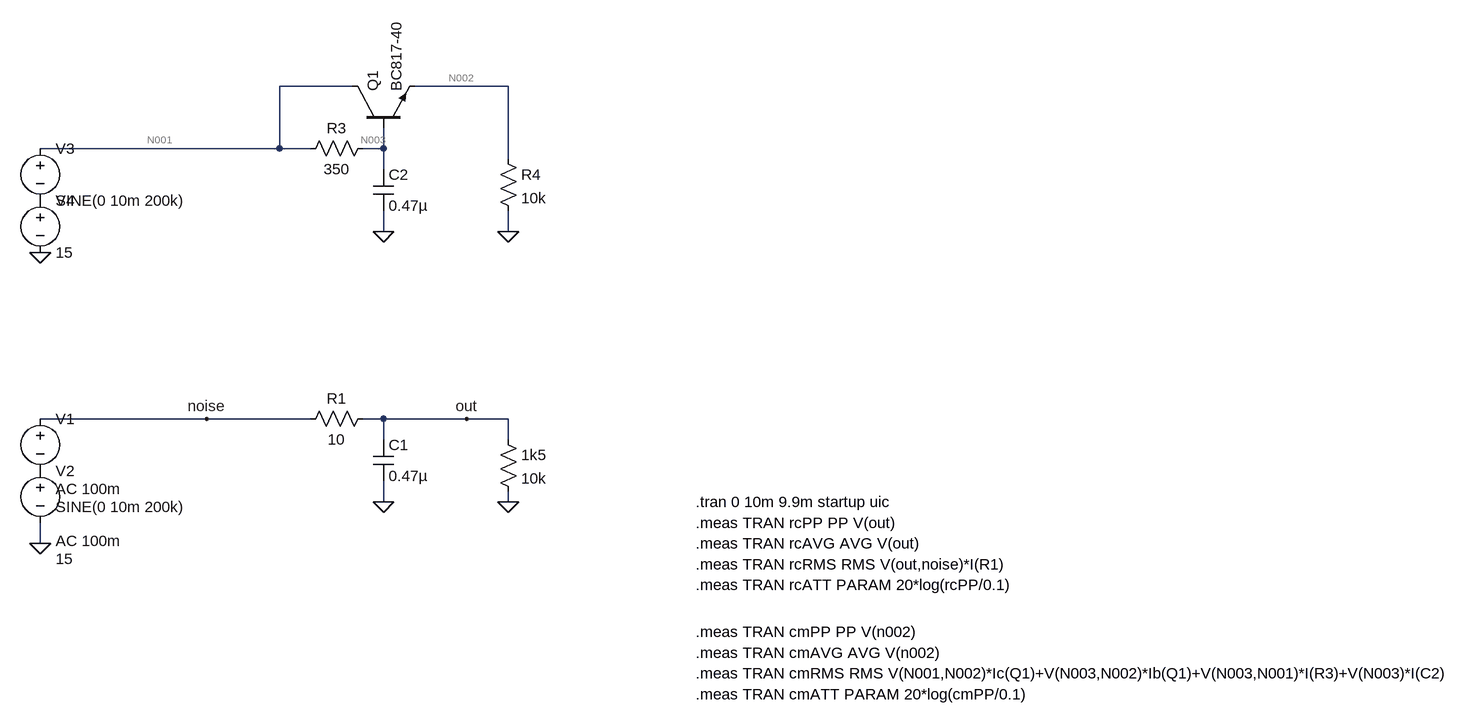
[diagram p0: schematic Capacitance multiplier.asc]
Capacitance multiplier.asc, the LTspice schematic file:
Version 4
SHEET 1 2472 732
WIRE 784 -432 672 -432
WIRE 1024 -432 880 -432
WIRE 672 -336 672 -432
WIRE 672 -336 304 -336
WIRE 720 -336 672 -336
WIRE 832 -336 832 -368
WIRE 832 -336 800 -336
WIRE 1024 -320 1024 -432
WIRE 832 -304 832 -336
WIRE 832 -208 832 -240
WIRE 1024 -208 1024 -240
WIRE 560 80 304 80
WIRE 720 80 560 80
WIRE 832 80 800 80
WIRE 960 80 832 80
WIRE 1024 80 960 80
WIRE 832 112 832 80
WIRE 1024 112 1024 80
WIRE 832 208 832 176
WIRE 1024 208 1024 192
WIRE 304 272 304 240
FLAG 304 272 0
FLAG 832 208 0
FLAG 560 80 noise
FLAG 960 80 out
FLAG 1024 208 0
FLAG 832 -208 0
FLAG 1024 -208 0
FLAG 304 -176 0
SYMBOL voltage 304 64 R0
WINDOW 3 24 152 Left 2
WINDOW 123 24 124 Left 2
WINDOW 39 0 0 Left 0
SYMATTR Value SINE(0 10m 200k)
SYMATTR Value2 AC 100m
SYMATTR InstName V1
SYMBOL res 816 64 R90
WINDOW 0 0 56 VBottom 2
WINDOW 3 32 56 VTop 2
SYMATTR InstName R1
SYMATTR Value 10
SYMBOL cap 816 112 R0
SYMATTR InstName C1
SYMATTR Value 0.47µ
SYMATTR SpiceLine V=25 Irms=3.94 Rser=0.0265693 Lser=0 mfg="KEMET" pn="C0603C474K3PAC" type="X5R"
SYMBOL voltage 304 144 R0
WINDOW 3 24 152 Left 2
WINDOW 123 24 124 Left 2
WINDOW 39 0 0 Left 0
SYMATTR Value 15
SYMATTR Value2 AC 100m
SYMATTR InstName V2
SYMBOL res 1008 96 R0
SYMATTR InstName 1k5
SYMATTR Value 10k
SYMBOL cap 816 -304 R0
SYMATTR InstName C2
SYMATTR Value 0.47µ
SYMATTR SpiceLine V=25 Irms=3.94 Rser=0.0265693 Lser=0 mfg="KEMET" pn="C0603C474K3PAC" type="X5R"
SYMBOL res 816 -352 R90
WINDOW 0 0 56 VBottom 2
WINDOW 3 32 56 VTop 2
SYMATTR InstName R3
SYMATTR Value 350
SYMBOL res 1008 -336 R0
SYMATTR InstName R4
SYMATTR Value 10k
SYMBOL voltage 304 -352 R0
WINDOW 123 0 0 Left 0
WINDOW 39 0 0 Left 0
SYMATTR InstName V3
SYMATTR Value SINE(0 10m 200k)
SYMBOL voltage 304 -272 R0
WINDOW 123 0 0 Left 0
WINDOW 39 0 0 Left 0
SYMATTR InstName V4
SYMATTR Value 15
SYMBOL npn 784 -368 R270
SYMATTR InstName Q1
SYMATTR Value BC817-40
TEXT 1312 208 Left 2 !.tran 0 10m 9.9m startup uic
TEXT 1312 240 Left 2 !.meas TRAN rcPP PP V(out)
TEXT 1312 408 Left 2 !.meas TRAN cmPP PP V(n002)
TEXT 1312 272 Left 2 !.meas TRAN rcAVG AVG V(out)
TEXT 1312 440 Left 2 !.meas TRAN cmAVG AVG V(n002)
TEXT 1312 304 Left 2 !.meas TRAN rcRMS RMS V(out,noise)*I(R1)
TEXT 1312 472 Left 2 !.meas TRAN cmRMS RMS V(N001,N002)*Ic(Q1)+V(N003,N002)*Ib(Q1)+V(N003,N001)*I(R3)+V(N003)*I(C2)
TEXT 1312 336 Left 2 !.meas TRAN rcATT PARAM 20*log(rcPP/0.1)
TEXT 1312 504 Left 2 !.meas TRAN cmATT PARAM 20*log(cmPP/0.1)

The netlist it stands for:
* Capacitance multiplier.asc
V1 noise P001 SINE(0 10m 200k) AC 100m
R1 out noise 10
C1 out 0 0.47µ V=25 Irms=3.94 Rser=0.0265693 Lser=0 mfg="KEMET" pn="C0603C474K3PAC" type="X5R"
V2 P001 0 15 AC 100m
R§1k5 out 0 10k
C2 N003 0 0.47µ V=25 Irms=3.94 Rser=0.0265693 Lser=0 mfg="KEMET" pn="C0603C474K3PAC" type="X5R"
R3 N003 N001 350
R4 N002 0 10k
V3 N001 P002 SINE(0 10m 200k)
V4 P002 0 15
Q1 N001 N003 N002 0 BC817-40
.model NPN NPN
.model PNP PNP
.lib standard.bjt
.tran 0 10m 9.9m startup uic
.meas TRAN rcPP PP V(out)
.meas TRAN cmPP PP V(n002)
.meas TRAN rcAVG AVG V(out)
.meas TRAN cmAVG AVG V(n002)
.meas TRAN rcRMS RMS V(out,noise)*I(R1)
.meas TRAN cmRMS RMS V(N001,N002)*Ic(Q1)+V(N003,N002)*Ib(Q1)+V(N003,N001)*I(R3)+V(N003)*I(C2)
.meas TRAN rcATT PARAM 20*log(rcPP/0.1)
.meas TRAN cmATT PARAM 20*log(cmPP/0.1)
.backanno
.end